# Altium schematic sheet eMMC_TPM.SchDoc
size A3
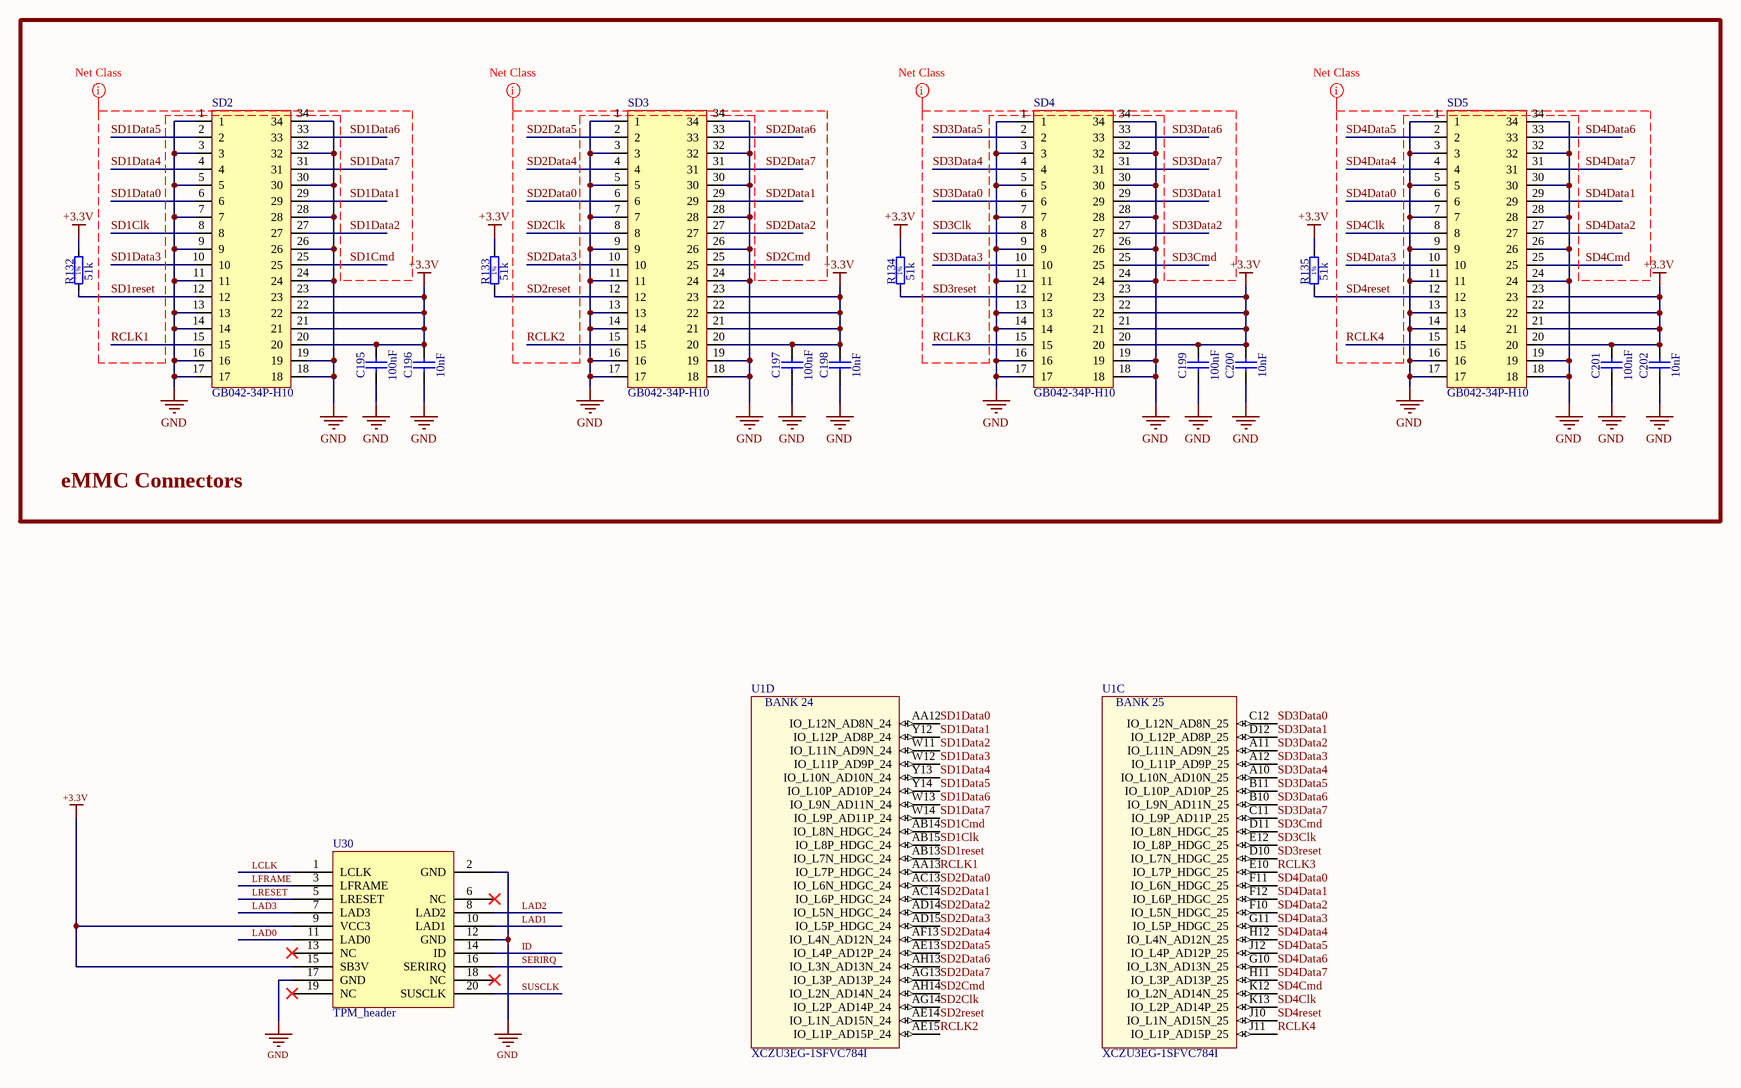
[diagram p0: eMMC_TPM.SchDoc]

## Parts
C195  100nF  [CAPC1608X87N]
C196  10nF  [CAPC1608X87N]
C197  100nF  [CAPC1608X87N]
C198  10nF  [CAPC1608X87N]
C199  100nF  [CAPC1608X87N]
C200  10nF  [CAPC1608X87N]
C201  100nF  [CAPC1608X87N]
C202  10nF  [CAPC1608X87N]
R132  51k  [RESC1608X55N]
R133  51k  [RESC1608X55N]
R134  51k  [RESC1608X55N]
R135  51k  [RESC1608X55N]
SD2  GB042-34P-H10  [GB042-34P-H10]
SD3  GB042-34P-H10  [GB042-34P-H10]
SD4  GB042-34P-H10  [GB042-34P-H10]
SD5  GB042-34P-H10  [GB042-34P-H10]
U1  XCZU3EG-1SFVC784I  [BGA784x28]  (parts C,D of 22)
U30  TPM_header  [PIN HEADER 20POS]

## Blocks framed on the sheet
eMMC Connectors: C195-C202 R132-R135 SD2-SD5

## Nets
+3.3V: C195.2 C196.2 C197.2 C198.2 C199.2 C200.2 C201.2 C202.2 R132.2 R133.2 R134.2 R135.2 SD2.20 SD2.21 SD2.22 SD2.23 SD3.20 SD3.21 SD3.22 SD3.23 SD4.20 SD4.21 SD4.22 SD4.23 SD5.20 SD5.21 SD5.22 SD5.23 U30.9(VCC3) U30.15(SB3V)
GND: C195.1 C196.1 C197.1 C198.1 C199.1 C200.1 C201.1 C202.1 SD2.1 SD2.3 SD2.5 SD2.7 SD2.9 SD2.11 SD2.13 SD2.14 SD2.16 SD2.17 SD2.18 SD2.19 SD2.24 SD2.26 SD2.28 SD2.30 SD2.32 SD2.34 SD3.1 SD3.3 SD3.5 SD3.7 SD3.9 SD3.11 SD3.13 SD3.14 SD3.16 SD3.17 SD3.18 SD3.19 SD3.24 SD3.26 SD3.28 SD3.30 SD3.32 SD3.34 SD4.1 SD4.3 SD4.5 SD4.7 SD4.9 SD4.11 SD4.13 SD4.14 SD4.16 SD4.17 SD4.18 SD4.19 SD4.24 SD4.26 SD4.28 SD4.30 SD4.32 SD4.34 SD5.1 SD5.3 SD5.5 SD5.7 SD5.9 SD5.11 SD5.13 SD5.14 SD5.16 SD5.17 SD5.18 SD5.19 SD5.24 SD5.26 SD5.28 SD5.30 SD5.32 SD5.34 U30.2(GND) U30.12(GND) U30.17(GND)
ID: U30.14(ID)
LAD0: U30.11(LAD0)
LAD1: U30.10(LAD1)
LAD2: U30.8(LAD2)
LAD3: U30.7(LAD3)
LCLK: U30.1(LCLK)
LFRAME: U30.3(LFRAME)
LRESET: U30.5(LRESET)
RCLK1: SD2.15 U1.AA13(IO_L7P_HDGC_24)
RCLK2: SD3.15 U1.AE15(IO_L1P_AD15P_24)
RCLK3: SD4.15 U1.E10(IO_L7P_HDGC_25)
RCLK4: SD5.15 U1.J11(IO_L1P_AD15P_25)
SD1Clk: SD2.8 U1.AB15(IO_L8P_HDGC_24)
SD1Cmd: SD2.25 U1.AB14(IO_L8N_HDGC_24)
SD1Data0: SD2.6 U1.AA12(IO_L12N_AD8N_24)
SD1Data1: SD2.29 U1.Y12(IO_L12P_AD8P_24)
SD1Data2: SD2.27 U1.W11(IO_L11N_AD9N_24)
SD1Data3: SD2.10 U1.W12(IO_L11P_AD9P_24)
SD1Data4: SD2.4 U1.Y13(IO_L10N_AD10N_24)
SD1Data5: SD2.2 U1.Y14(IO_L10P_AD10P_24)
SD1Data6: SD2.33 U1.W13(IO_L9N_AD11N_24)
SD1Data7: SD2.31 U1.W14(IO_L9P_AD11P_24)
SD1reset: R132.1 SD2.12 U1.AB13(IO_L7N_HDGC_24)
SD2Clk: SD3.8 U1.AG14(IO_L2P_AD14P_24)
SD2Cmd: SD3.25 U1.AH14(IO_L2N_AD14N_24)
SD2Data0: SD3.6 U1.AC13(IO_L6N_HDGC_24)
SD2Data1: SD3.29 U1.AC14(IO_L6P_HDGC_24)
SD2Data2: SD3.27 U1.AD14(IO_L5N_HDGC_24)
SD2Data3: SD3.10 U1.AD15(IO_L5P_HDGC_24)
SD2Data4: SD3.4 U1.AF13(IO_L4N_AD12N_24)
SD2Data5: SD3.2 U1.AE13(IO_L4P_AD12P_24)
SD2Data6: SD3.33 U1.AH13(IO_L3N_AD13N_24)
SD2Data7: SD3.31 U1.AG13(IO_L3P_AD13P_24)
SD2reset: R133.1 SD3.12 U1.AE14(IO_L1N_AD15N_24)
SD3Clk: SD4.8 U1.E12(IO_L8P_HDGC_25)
SD3Cmd: SD4.25 U1.D11(IO_L8N_HDGC_25)
SD3Data0: SD4.6 U1.C12(IO_L12N_AD8N_25)
SD3Data1: SD4.29 U1.D12(IO_L12P_AD8P_25)
SD3Data2: SD4.27 U1.A11(IO_L11N_AD9N_25)
SD3Data3: SD4.10 U1.A12(IO_L11P_AD9P_25)
SD3Data4: SD4.4 U1.A10(IO_L10N_AD10N_25)
SD3Data5: SD4.2 U1.B11(IO_L10P_AD10P_25)
SD3Data6: SD4.33 U1.B10(IO_L9N_AD11N_25)
SD3Data7: SD4.31 U1.C11(IO_L9P_AD11P_25)
SD3reset: R134.1 SD4.12 U1.D10(IO_L7N_HDGC_25)
SD4Clk: SD5.8 U1.K13(IO_L2P_AD14P_25)
SD4Cmd: SD5.25 U1.K12(IO_L2N_AD14N_25)
SD4Data0: SD5.6 U1.F11(IO_L6N_HDGC_25)
SD4Data1: SD5.29 U1.F12(IO_L6P_HDGC_25)
SD4Data2: SD5.27 U1.F10(IO_L5N_HDGC_25)
SD4Data3: SD5.10 U1.G11(IO_L5P_HDGC_25)
SD4Data4: SD5.4 U1.H12(IO_L4N_AD12N_25)
SD4Data5: SD5.2 U1.J12(IO_L4P_AD12P_25)
SD4Data6: SD5.33 U1.G10(IO_L3N_AD13N_25)
SD4Data7: SD5.31 U1.H11(IO_L3P_AD13P_25)
SD4reset: R135.1 SD5.12 U1.J10(IO_L1N_AD15N_25)
SERIRQ: U30.16(SERIRQ)
SUSCLK: U30.20(SUSCLK)

Not connected (* = marked no-connect by the designer): U30 6(NC)* 13(NC)* 18(NC)* 19(NC)*

## Layout directives
net class SD1: RCLK1, SD1Clk, SD1Cmd, SD1Data0, SD1Data1, SD1Data2, SD1Data3, SD1Data4, SD1Data5, SD1Data6, SD1Data7, SD1reset
net class SD2: RCLK2, SD2Clk, SD2Cmd, SD2Data0, SD2Data1, SD2Data2, SD2Data3, SD2Data4, SD2Data5, SD2Data6, SD2Data7, SD2reset
net class SD3: RCLK3, SD3Clk, SD3Cmd, SD3Data0, SD3Data1, SD3Data2, SD3Data3, SD3Data4, SD3Data5, SD3Data6, SD3Data7, SD3reset
net class SD4: RCLK4, SD4Clk, SD4Cmd, SD4Data0, SD4Data1, SD4Data2, SD4Data3, SD4Data4, SD4Data5, SD4Data6, SD4Data7, SD4reset

## Notes on the sheet
- (in symbol R0603_51K_1%_0.1W_100PPM) 1%
- (in symbol XCZU3EG-1SFVC784I, part C) BANK 25
- (in symbol XCZU3EG-1SFVC784I, part D) BANK 24

## Library data of the parts
C195 C197 C199 C201 = CC0603_100NF_50V_10%_X7R: Non-polarised capacitor; Part Description: SMD Multilayer Chip Ceramic Capacitor; Manufacturer: MULTICOMP; Manufacturer Part Number: MCB0603R104KCT; Manufacturer1 Part Number: 223858615649; Voltage: 50V; TC: X7R; Tolerance: ±10%; Table: Capacitors SMD; Voltage Rating: 16; Capacitance: 0.1; SVHC: No SVHC (17-Dec-2015); Ceramic Capacitor Case: 0603 [1608 Metric]; Dielectric Characteristic: X7; Product Range: MCB Series; Capacitance Tolerance: ± 10%; Capacitor Terminals: SMD; Part Number: CC0603_100NF_50V_10%_X7R; Component Kind: Standard; Component Type: Standard; Pin Count: 2; Value: 100nF; Status: Preferred; Case: 0603; Mounted: Yes; Socket: No; SMD: Yes; Manufacturer1 Example: PHYCOMP; Manufacturer1 ComponentHeight: 0.87mm; HelpURL: \\cern.ch\dfs\Applications\Altium\Datasheets\CC0603_X7R_PHYCOMP.pdf; Author: CERN DEM JLC; CreateDate: 3.12.2007; LatestRevisionDate: 3.12.2007; RoHS: YES; Packaging: Cut Tape; Operating Temperature Min: -55; MSL: -; Supplier Part Number: 9406140; Operating Temperature Range: -55°C to +125°C<!--FANDB--><div class="features-and-benefits-container"><div class="features-and-benefits-description"><span class="features-benefits-value">The MCB0603R104KCT is a multilayer Ceramic Capacitor with 0603 chip, for general digital circuit. Consists of a conducting material and electrodes. To manufacture a chip-type SMT and achieve miniaturization, high density and high efficiency, ceramic condensers are used. MLCC is made by X7; Supplier: Farnell; Capacitance Tolerance ±: ± 10%; Operating Temperature Max: 125
C196 C198 C200 C202 = CC0603_10NF_50V_10%_X7R: Non-polarised capacitor; Part Description: SMD Multilayer Chip Ceramic Capacitor; Manufacturer: MULTICOMP; Manufacturer Part Number: MC0603B103K500CT; Manufacturer1 Part Number: 223858615636; Voltage: 50V; TC: X7R; Tolerance: ±10%; Table: Capacitors SMD; Voltage Rating: 50; Product Range: MC Series; No. of Pins: 2; Capacitor Terminals: SMD; Ceramic Capacitor Case: 0603 [1608 Metric]; SVHC: No SVHC (17-Dec-2015); Capacitance Tolerance ±: ± 10%; External Length / Height: 0.8; Dielectric Characteristic: X7; External Depth: 1.6; Capacitance: 0.01; Part Number: CC0603_10NF_50V_10%_X7R; Component Kind: Standard; Component Type: Standard; Pin Count: 2; Value: 10nF; Status: Preferred; Case: 0603; Mounted: Yes; Socket: No; SMD: Yes; Manufacturer1 Example: PHYCOMP; Manufacturer1 ComponentHeight: 0.87mm; HelpURL: \\cern.ch\dfs\Applications\Altium\Datasheets\CC0603_X7R_PHYCOMP.pdf; Author: CERN DEM JLC; CreateDate: 3.12.2007; LatestRevisionDate: 3.12.2007; Operating Temperature Range: -55°C to +125°C<!--FANDB--><div class="features-and-benefits-container"><div class="features-and-benefits-description"><span class="features-benefits-value">The Multicomp MC series is general purpose MLCC capacitors with X7R dielectric material which provides high electrical precision, stability and reliability. This MLCC capacitor consists of a conducting material and electrodes with high density and high efficiency ceramic condensers.</span></div><div class="features-and-benefits-list"><ul class="features-and-benefits-list-list"><li class="features-and-benefits-list-item">Small size with higher capacitance values</li><li class="features-and-benefits-list-item">0201, 0402, 0603, 0805, 1206, 1210, 1812 case sizes available</li><li class="features-and-benefits-list-item">Capacitance value ranging from 100pF to 47?F</li><li class="features-and-benefits-list-item">Capacitor with lead free termination (pure Tin)</li><li class="features-and-benefits-list-item">High electrical precision, stability and reliability</li><li class="features-and-benefits-list-item">Rated voltage of 6.3V, 10V, 16V, 25V, 50V, 100V</li><li class="features-and-benefits-list-item">Operating temperature of -55°C to +125°C</li><li class="features-and-benefits-list-item">Available in ±5%, ±10% and ±20; MSL: -; Supplier: Farnell; Capacitance Tolerance: ± 10%; External Width: 0.8; Supplier Part Number: 1759102; Packaging: Cut Tape; Operating Temperature Max: 125; Operating Temperature Min: -55; RoHS: YES
R132-R135 = R0603_51K_1%_0.1W_100PPM: Resistor - 1%; Part Description: General Purpose Thick Film Chip Resistor; Manufacturer: Yageo; Manufacturer Part Number: RC0603JR-0751KL; Manufacturer1 Part Number: NRC06F5102TRF; Power: 0.1W; TC: ±100ppm/°C; Tolerance: ±5%; Table: Resistors SMD; Power (Watts): 0.1W, 1/10W; Part Number: R0603_51K_1%_0.1W_100PPM; Component Kind: Standard; Component Type: Standard; Pin Count: 2; Value: 51k; Status: Preferred; Case: 0603; Mounted: Yes; Socket: No; SMD: Yes; Manufacturer1 Example: NIC COMPONENT; Manufacturer1 ComponentHeight: 0.55mm; HelpURL: \\cern.ch\dfs\Applications\Altium\Datasheets\R0603_NIC_NRC.pdf; Author: CERN DEM JLC; CreateDate: 3.12.2007; LatestRevisionDate: 13.03.2008; Height: 0.022" (0.55mm); Features: Moisture Resistant; RoHS: RoHS Compliant; Number of Terminations: 2; Category: Resistors; Composition: Thick Film; Resistance (Ohms): 51k; Size / Dimension: 0.063" L x 0.031" W (1.60mm x 0.80mm); Supplier Part Number: 311-51KGRCT-ND; Supplier Device Package: 0603; Package / Case: 0603 (1608 Metric); Supplier: Digi-Key; Temperature Coefficient: ±100ppm/°C; Packaging: Cut Tape (CT); Operating Temperature: -55°C ~ 155°C
SD2-SD5 = GB042-34P-H10: Connector, eMMC
U1 = XCZU3EG-1SFVC784I: IC FPGA 252 I/O 784FCBGA - XILINX ZYNQ ULTRASCALE+; Manufacturer 1: Xilinx Inc.; Package: SFVC784; ComponentLink1Description: Datasheet; Supplier 1: Digi-Key; Supplier Part Number 1: XCZU3EG-1SFVC784I-ND; Manufacturer Part Number 1: XCZU3EG-1SFVC784I
U30 = TPM_header: GC-TPM-rev-20; Controller: Infineon SLB9665TT2.0 FW5.51; Interface: TPM header key, LPC bus PH/2*10K4/BUL/2.54; Motherboard: GIGABYTE